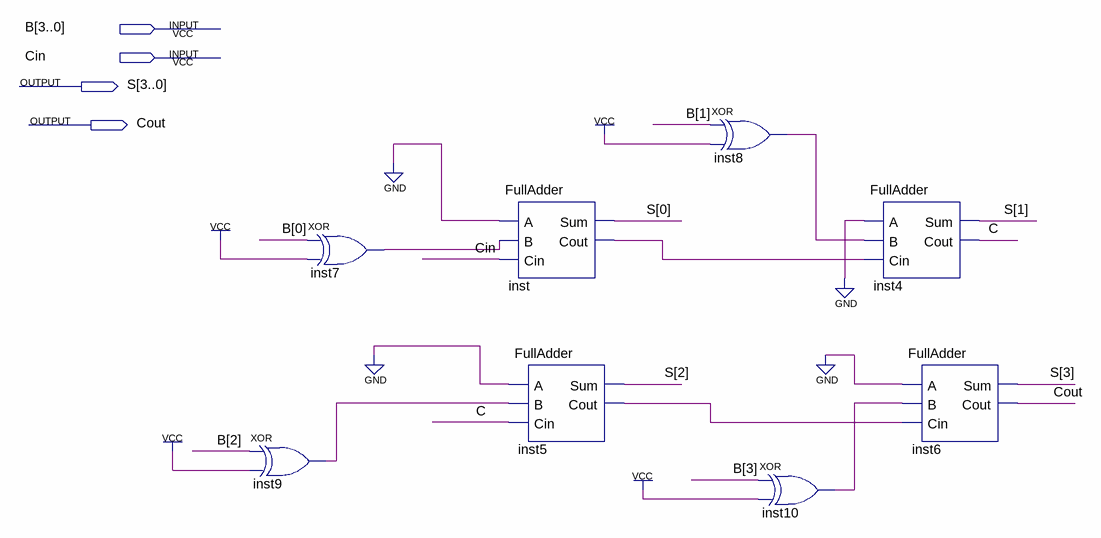
[diagram p0: schematic sheet]
// Quartus schematic 0doibitcuoi.bdf as structural Verilog: 8 symbols, 4 pins
module \0doibitcuoi  (
  input  [3:0] B,
  input  Cin,
  output [3:0] S,
  output Cout
);

  wire C, inst5_cout, inst7_out, inst8_out, inst9_out, inst10_out, inst_cout;

  xor inst7 (inst7_out, B[0], 1'b1);
  xor inst9 (inst9_out, B[2], 1'b1);
  FullAdder inst (.A(1'b0), .B(inst7_out), .Cin(Cin), .Sum(S[0]), .Cout(inst_cout));
  FullAdder inst5 (.A(1'b0), .B(inst9_out), .Cin(C), .Sum(S[2]), .Cout(inst5_cout));
  xor inst8 (inst8_out, B[1], 1'b1);
  xor inst10 (inst10_out, B[3], 1'b1);
  FullAdder inst4 (.A(1'b0), .B(inst8_out), .Cin(inst_cout), .Sum(S[1]), .Cout(C));
  FullAdder inst6 (.A(1'b0), .B(inst10_out), .Cin(inst5_cout), .Sum(S[3]), .Cout(Cout));
endmodule
